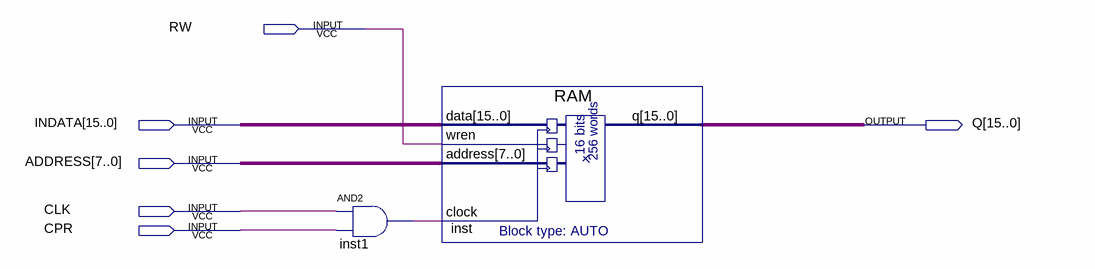
[diagram p0: schematic sheet]
// Quartus schematic testRAM.bdf as structural Verilog: 2 symbols, 6 pins
module testRAM (
  input  RW,
  input  [15:0] INDATA,
  input  [7:0] ADDRESS,
  input  CLK,
  input  CPR,
  output [15:0] Q
);

  wire inst1_out;

  and inst1 (inst1_out, CLK, CPR);
  RAM inst (.data(INDATA), .wren(RW), .address(ADDRESS), .clock(inst1_out), .q(Q));
endmodule
